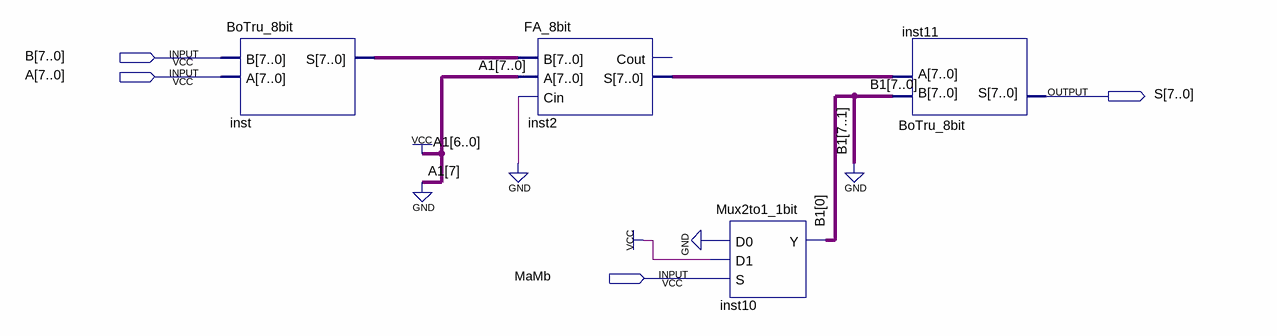
[diagram p0: schematic sheet]
// Quartus schematic E_Normalizer_Division.bdf as structural Verilog: 4 symbols, 4 pins
module E_Normalizer_Division (
  input  [7:0] B,
  input  [7:0] A,
  input  MaMb,
  output [7:0] S
);

  wire [0:0] B1;
  wire [7:0] inst2_s, inst_s;

  BoTru_8bit inst (.B(B), .A(A), .S(inst_s));
  FA_8bit inst2 (.B(inst_s), .A(8'b01111111), .Cin(1'b0), .S(inst2_s));  // open: Cout
  Mux2to1_1bit inst10 (.D0(1'b0), .D1(1'b1), .S(MaMb), .Y(B1[0]));
  BoTru_8bit inst11 (.B({{7{1'b0}}, B1[0]}), .A(inst2_s), .S(S));
endmodule
